# Altium schematic sheet base.SchDoc: SubControl
size A4; DrawnBy: BUPT_HCM; Revision: A; SheetNumber: 2; SheetTotal: 2; Version: 2.0; LibVersion: 0.0
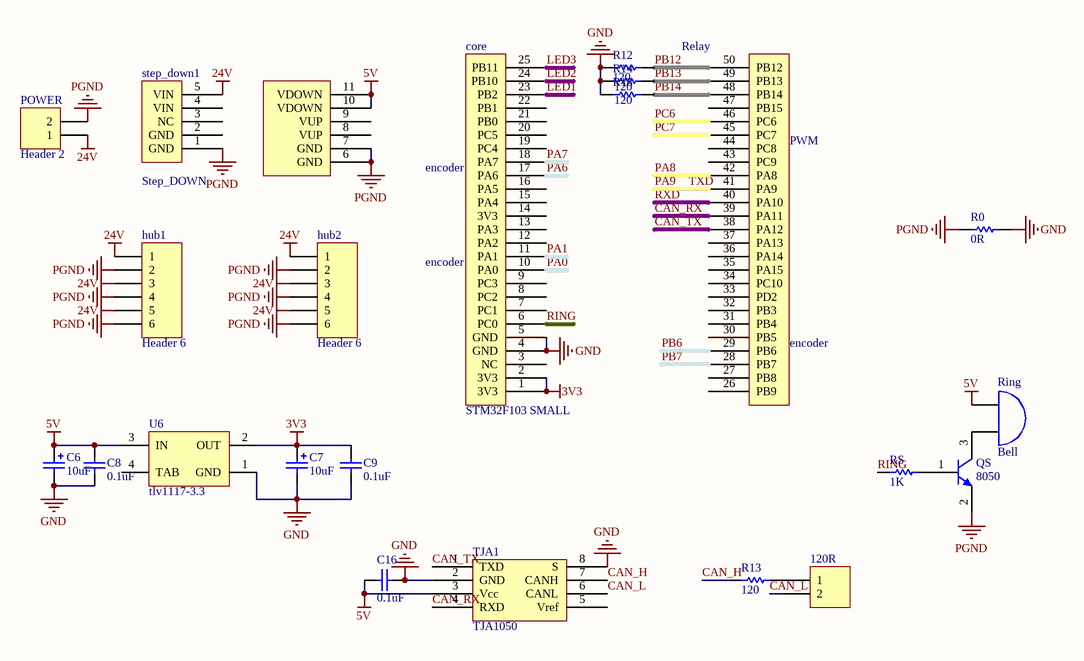
[diagram p0: base.SchDoc]

## Parts
120R  Header 2  [SIP2]  (value not drawn)
C6  value 10uF  [6032C]  (hidden comment: Cap Pol1)
C7  value 10uF  [6032C]  (hidden comment: Cap Pol1)
C8  value 0.1uF  [CAP-MLCC-0603]  (hidden comment: Cap)
C9  value 0.1uF  [CAP-MLCC-0603]  (hidden comment: Cap)
C16  value 0.1uF  [CAP-MLCC-0603]  (hidden comment: Cap)
core  STM32F103 SMALL  [STM32F103Small]
hub1  Header 6  [Green_6P]
hub2  Header 6  [Green_6P]
POWER  Header 2  [Green_2P]
QS  8050  [SOT-23B_N]
R0  value 0R  [RES-0603]  (hidden comment: Res1)
R12  value 120  [RES-0603]  (hidden comment: Res1)
R13  value 120  [RES-0603]  (hidden comment: Res1)
R14  value 120  [RES-0603]  (hidden comment: Res1)
R18  value 120  [RES-0603]  (hidden comment: Res1)
Ring  Bell  [Ring]
RS  value 1K  [RES-0603]  (hidden comment: Res1)
step_down1  Step_DOWN  [Step_Up_Down]
TJA1  TJA1050  [TJA1050]
U6  tlv1117-3.3  [LM1117]

## Nets
3V3: C7.1 C9.2 core.1(3V3) core.2(3V3) U6.2(OUT)
5V: C6.1 C8.2 C16.1 Ring.1(A) step_down1.10(VDOWN) step_down1.11(VDOWN) TJA1.3(Vcc) U6.3(IN)
24V: hub1.1 hub1.3 hub1.5 hub2.1 hub2.3 hub2.5 POWER.1 step_down1.5(VIN)
GND: C6.2 C7.2 C8.1 C9.1 C16.2 core.4(GND) core.5(GND) R0.1 R12.1 R14.1 R18.1 TJA1.2(GND) TJA1.8(S) U6.1(GND)
PGND: hub1.2 hub1.4 hub1.6 hub2.2 hub2.4 hub2.6 POWER.2 QS.2(E) R0.2 step_down1.1(GND) step_down1.6(GND) step_down1.7(GND)
CAN_H: R13.2 TJA1.7(CANH)
CAN_L: 120R.2 TJA1.6(CANL)
CAN_RX: core.39(PA11) TJA1.4(RXD)
CAN_TX: core.38(PA12) TJA1.1(TXD)
LED1: core.23(PB2)
LED2: core.24(PB10)
LED3: core.25(PB11)
PA0: core.10(PA0)
PA1: core.11(PA1)
PA6: core.17(PA6)
PA7: core.18(PA7)
PA8: core.42(PA8)
PA9: core.41(PA9)  [also labelled TXD]
PB6: core.29(PB6)
PB7: core.28(PB7)
PB12: core.50(PB12) R12.2
PB13: core.49(PB13) R14.2
PB14: core.48(PB14) R18.2
PC6: core.46(PC6)
PC7: core.45(PC7)
RING: core.6(PC0) RS.2
RXD: core.40(PA10)
Net120R_1: 120R.1 R13.1
NetQS_1: QS.1(B) RS.1
NetQS_3: QS.3(C) Ring.2(B)

Not connected (* = marked no-connect by the designer): core 3(NC) 7(PC1) 8(PC2) 9(PC3) 12(PA2) 13(PA3) 14(3V3) 15(PA4) 16(PA5) 19(PC4) 20(PC5) 21(PB0) 22(PB1) 26(PB9) 27(PB8) 30(PB5) 31(PB4) 32(PB3) 33(PD2) 34(PC10) 35(PA15) 36(PA14) 37(PA13) 43(PC9) 44(PC8) 47(PB15); step_down1 2(GND) 3(NC) 4(VIN) 8(VUP) 9(VUP); TJA1 5(Vref); U6 4(TAB)

## Notes on the sheet
- (near core) Relay
- (near core) encoder
- (near core) PWM
- Title:
- Size:
- Date:
- File:
- A4
- Version:
- Revision:
- Drawn By
- Sheet
- Library:
- of

## Library data of the parts
120R POWER = Header 2: Header, 2-Pin; LatestRevisionDate: 17-Jul-2002; LatestRevisionNote: Re-released for DXP Platform.; Publisher: Altium Limited
C6 C7 = Cap Pol1: Polarized Capacitor (Radial); Published: 8-Jun-2000; LatestRevisionDate: 17-Jul-2002; LatestRevisionNote: Re-released for DXP Platform.; PackageReference: RB7.6-15; Publisher: Altium Limited
C8 C9 C16 = Cap: Capacitor; Published: 8-Jun-2000; LatestRevisionDate: 17-Jul-2002; LatestRevisionNote: Re-released for DXP Platform.; PackageReference: RAD-0.3; Publisher: Altium Limited
hub1 hub2 = Header 6: Header, 6-Pin; LatestRevisionDate: 17-Jul-2002; LatestRevisionNote: Re-released for DXP Platform.; Publisher: Altium Limited
QS = QNPN: NPN Bipolar Transistor; Published: 8-Jun-2000; LatestRevisionDate: 29-May-2009; LatestRevisionNote: IPC-7351 Footprint Added.; PackageVersion: Aug-1999; PackageReference: SOT-23B; Publisher: Altium Limited; PackageDescription: 3-Pin SOT-23 Package 0.95 mm Pitch, 2.4 mm Lead Span
R0 R12-R14 R18 RS = Res1: Resistor; Published: 8-Jun-2000; LatestRevisionDate: 17-Jul-2002; LatestRevisionNote: Re-released for DXP Platform.; PackageReference: AXIAL-0.3; Publisher: Altium Limited
Ring = Bell: Electrical Bell; Published: 24-Mar-1999; LatestRevisionDate: 17-Jul-2002; LatestRevisionNote: Re-released for DXP Platform.; PackageReference: PIN2; Publisher: Altium Limited
TJA1 = TJA1050: CAN总线收发器
U6 = LM1117IMP-5.0: 800mA Low-Dropout Linear Regulator; Manufacturer: National Semiconductor; CompType: LDO IC; PackageTopMarking: XYTT*N06B; PowerWise: N; Published: 4-Dec-2008; DatasheetVersion: Apr-2006; PackageVersion: revB, Apr-2003; PackageReference: MP04A; Publisher: Altium Limited; PackageDescription: Molded SOT-223, 6.50 x 3.56 x 1.6mm Body, 4 Lead, 2.3mm Pitch; PartNumber: LM1117IMP-5.0; RoHS: O; PinCount: 4; DigiKeyPartNumber: LM1117IMP-5.0CT-ND; Code_JEDEC: TO-261-AA; Code_IPC: SOT223-4; ComponentLink1Description: LM1117 Datasheet; ComponentLink1URL: http://www.national.com/ds/LM/LM1117.pdf; ComponentLink2Description: LM1117 Web Page; ComponentLink2URL: http://www.national.com/pf/LM/LM1117.html; ComponentLink3Description: MP04A Package Page; ComponentLink3URL: http://www.national.com/packaging/folders/mp04a.html